# EAGLE schematic EpleyUnoMotorShield (EAGLE 7.2.0)
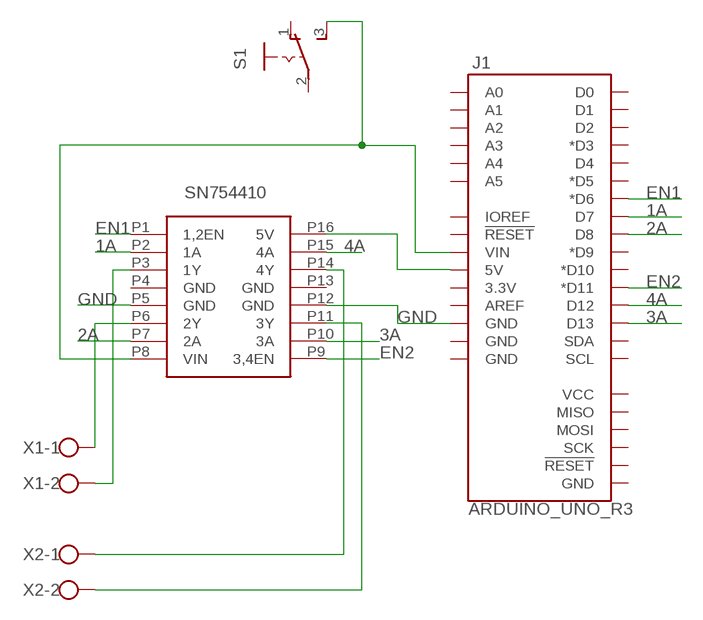
[diagram p0: schematic, sheet 1]

## Parts
J1  ARDUINO_UNO_R3  [ARDUINO_R3]
S1  SLIDE_SWITCH  [SLIDE_SWITCH]
U$1  MOTOR_DRIVERDIP16  [DIP16]
X1  SCREWCONNECTOR  [2PIN-SCREW-TERMINAL]
X2  SCREWCONNECTOR  [2PIN-SCREW-TERMINAL]

## Nets
1A: J1.D7 U$1.P2(1A)
2A: J1.D8 U$1.P7(2A)
3A: J1.D13 U$1.P10(3A)
4A: J1.D12 U$1.P15(4A)
EN1: J1.D6(*D6) U$1.P1(1,2EN)
EN2: J1.D11(*D11) U$1.P9(3,4EN)
GND: J1.GND@4(GND) U$1.P5(GND) U$1.P12(GND)
N$1: U$1.P6(2Y) X1.1
N$2: U$1.P3(1Y) X1.2
N$3: U$1.P14(4Y) X2.1
N$4: U$1.P11(3Y) X2.2
N$5: J1.5V U$1.P16(5V)
N$7: J1.VIN S1.3(S) U$1.P8(VIN)
Unconnected: J1.3.3V J1.A0 J1.A1 J1.A2 J1.A3 J1.A4 J1.A5 J1.AREF J1.D0 J1.D1 J1.D2 J1.D3(*D3) J1.D4 J1.D5(*D5) J1.D9(*D9) J1.D10(*D10) J1.GND@1(GND) J1.GND@2(GND) J1.GND@3(GND) J1.IOREF J1.MISO J1.MOSI J1.RESET@1(!RESET!) J1.RESET@2(!RESET!) J1.SCK J1.SCL J1.SDA J1.VCC S1.1(O) S1.2(P)

## Power pins joined to a net without a drawn wire
GND: U$1.P4(GND) U$1.P13(GND)

## Library data of the parts
J1 = ISCTRainingProgram:ARDUINO_UNO_R3: Arduino R3 Footprint (w/ SPI header)
S1 = ISCTRainingProgram:SLIDE_SWITCH: SLIDING SWITCH Distributor Buerklin, 11G810
U$1 = ISCTRainingProgram:MOTOR_DRIVER: The SN754410 is a quadruple high-current half-H driver designed to provide bidirectional drive currents up to 1 A at voltages from 4.5 V to 36 V. The device is designed to drive inductive loads such as relays, solenoids, DC and bipolar stepping motors, as well as other high-current/high-voltage loads in positive-supply applications.
X1 X2 = ISCTRainingProgram:SCREWCONNECTOR: WAGO SCREW CLAMP; MPN: 237-102; OC_FARNELL: unknown; OC_NEWARK: 70K9898